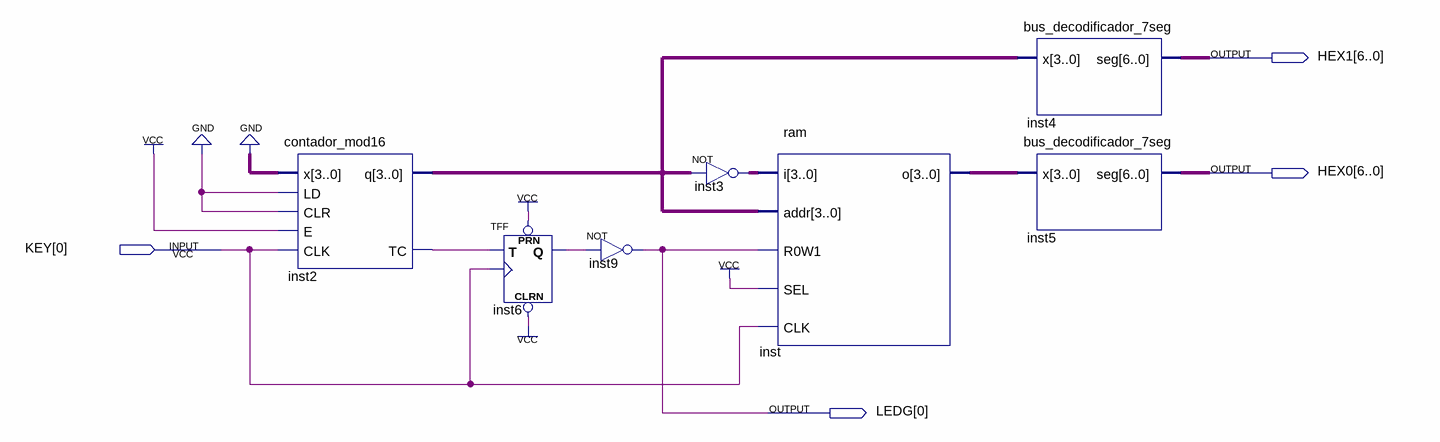
[diagram p0: schematic sheet]
// Quartus schematic teste_RAM.bdf as structural Verilog: 7 symbols, 4 pins
module teste_RAM (
  input  [0:0] KEY,
  output [6:0] HEX1,
  output [6:0] HEX0,
  output [0:0] LEDG
);

  wire inst2_tc, inst6_q;
  wire [3:0] inst2_q, inst3_out, inst_o;

  contador_mod16 inst2 (.x(4'b0000), .LD(1'b0), .CLR(1'b0), .CLK(KEY[0]), .E(1'b1), .q(inst2_q), .TC(inst2_tc));
  TFF inst6 (.PRN(1'b1), .CLRN(1'b1), .T(inst2_tc), .CLK(KEY[0]), .Q(inst6_q));
  not inst9 (LEDG[0], inst6_q);
  assign inst3_out = ~inst2_q;  // NOT inst3, 4 bits wide
  ram inst (.i(inst3_out), .SEL(1'b1), .addr(inst2_q), .R0W1(LEDG[0]), .CLK(KEY[0]), .o(inst_o));
  bus_decodificador_7seg inst4 (.x(inst2_q), .seg(HEX1));
  bus_decodificador_7seg inst5 (.x(inst_o), .seg(HEX0));
endmodule
